# Altium schematic sheet RobotCtrl_Power.SchDoc
size A3; Author: Power Lin; DocumentNumber: 1; Revision: 0.3B; SheetNumber: 1; SheetTotal: 1; Website: wiki-power.com
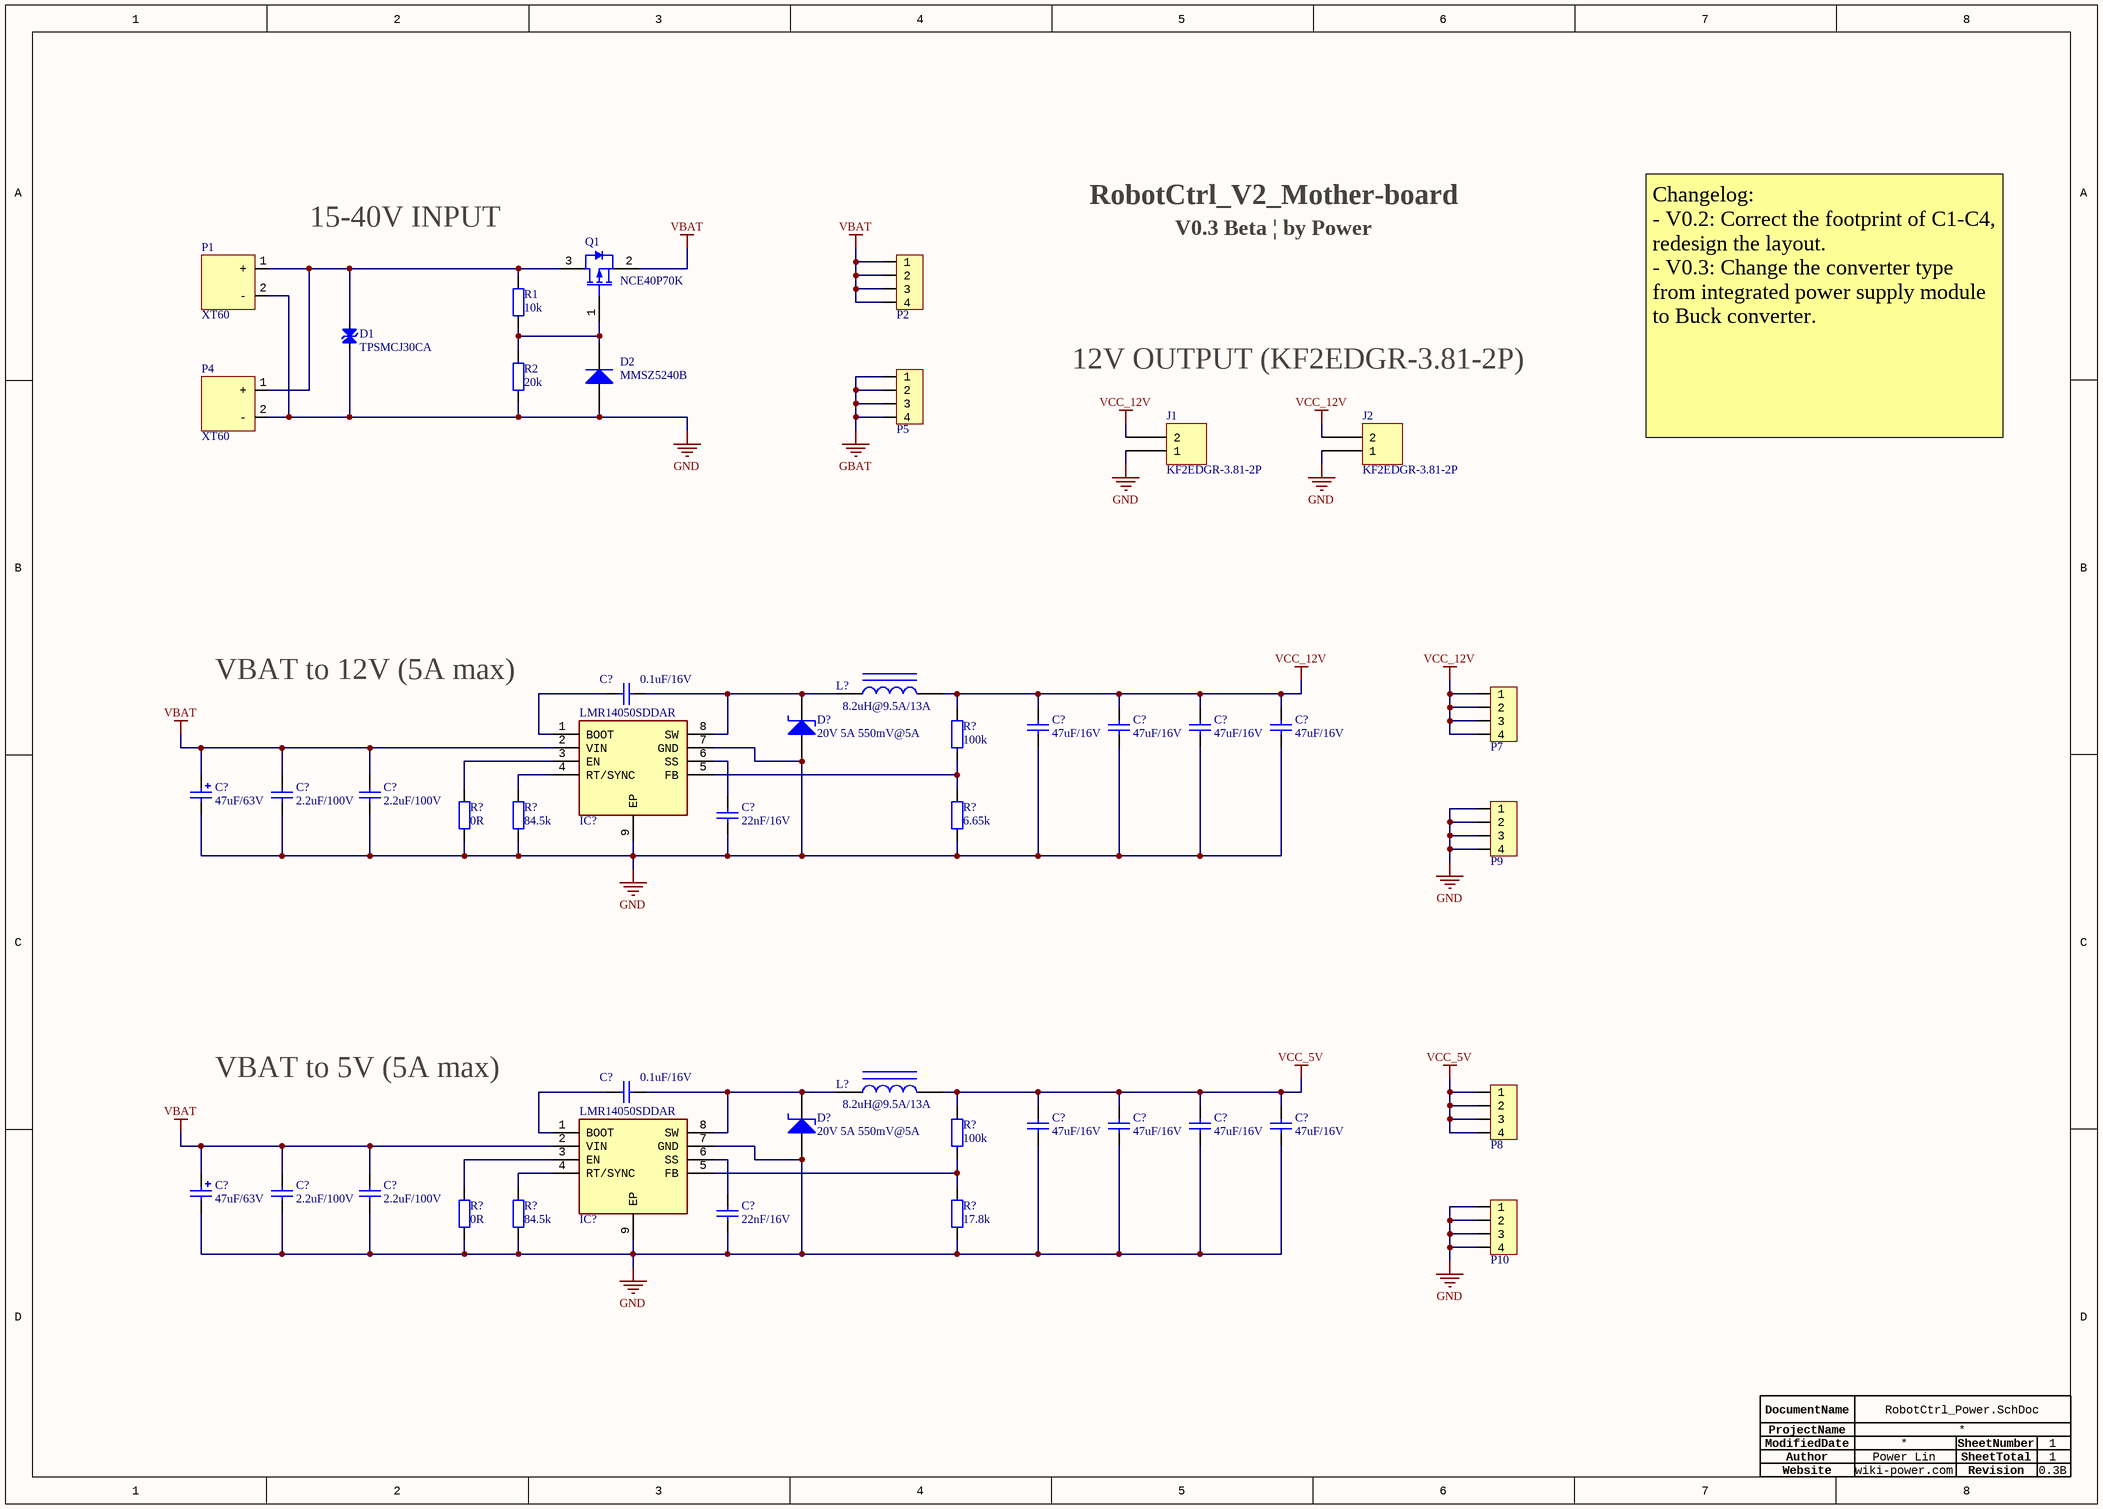
[diagram p0: RobotCtrl_Power.SchDoc]

## Parts
(Parts that share a designator on the sheet are numbered #1, #2 ... from top to bottom, then left to right.)
C?#1  0.1uF/16V  [CAP-0603]
C?#2  47uF/63V  [C_SMD-8X10]
C?#3  47uF/16V  [CAP-1210]
C?#4  47uF/16V  [CAP-1210]
C?#5  47uF/16V  [CAP-1210]
C?#6  47uF/16V  [CAP-1210]
C?#7  2.2uF/100V  [CAP-1206]
C?#8  2.2uF/100V  [CAP-1206]
C?#9  22nF/16V  [CAP-0603]
C?#10  0.1uF/16V  [CAP-0603]
C?#11  47uF/63V  [C_SMD-8X10]
C?#12  47uF/16V  [CAP-1210]
C?#13  47uF/16V  [CAP-1210]
C?#14  47uF/16V  [CAP-1210]
C?#15  47uF/16V  [CAP-1210]
C?#16  2.2uF/100V  [CAP-1206]
C?#17  2.2uF/100V  [CAP-1206]
C?#18  22nF/16V  [CAP-0603]
D1  TPSMCJ30CA  [DO-214AB/SMC]
D2  MMSZ5240B  [SOD_123]
D?#1  20V 5A 550mV@5A  [DO-214AB/SMC]
D?#2  20V 5A 550mV@5A  [DO-214AB/SMC]
IC?#1  LMR14050SDDAR  [HSOIC-8]
IC?#2  LMR14050SDDAR  [HSOIC-8]
J1  KF2EDGR-3.81-2P  [FCI 06-381-2PIN]
J2  KF2EDGR-3.81-2P  [FCI 06-381-2PIN]
L?#1  8.2uH@9.5A/13A  [SMD-13.45x12.6x4.8mm]
L?#2  8.2uH@9.5A/13A  [SMD-13.45x12.6x4.8mm]
P1  XT60  [XT60PW-M]
P2  HDR1x4_2.54  [HDR1x4_2.54_180]  (value not drawn)
P4  XT60  [XT60PW-M]
P5  HDR1x4_2.54  [HDR1x4_2.54_180]  (value not drawn)
P7  HDR1x4_2.54  [HDR1x4_2.54_180]  (value not drawn)
P8  HDR1x4_2.54  [HDR1x4_2.54_180]  (value not drawn)
P9  HDR1x4_2.54  [HDR1x4_2.54_180]  (value not drawn)
P10  HDR1x4_2.54  [HDR1x4_2.54_180]  (value not drawn)
Q1  NCE40P70K  [TO-252]
R1  10k  [R-0603]
R2  20k  [R-0603]
R?#1  100k  [R-0603]
R?#2  0R  [R-0603]
R?#3  84.5k  [R-0603]
R?#4  6.65k  [R-0603]
R?#5  100k  [R-0603]
R?#6  0R  [R-0603]
R?#7  84.5k  [R-0603]
R?#8  17.8k  [R-0603]

## Nets
GBAT: P5.1 P5.2 P5.3 P5.4
GND: C?#2.2 C?#3.1 C?#4.1 C?#5.1 C?#6.1 C?#7.1 C?#8.1 C?#9.1 C?#11.2 C?#12.1 C?#13.1 C?#14.1 C?#15.1 C?#16.1 C?#17.1 C?#18.1 D1.1 D2.1(A) D?#1.1(A) D?#2.1(A) IC?#1.7(GND) IC?#1.9(EP) IC?#2.7(GND) IC?#2.9(EP) J1.1 J2.1 P1.2(-) P4.2(-) P9.1 P9.2 P9.3 P9.4 P10.1 P10.2 P10.3 P10.4 R2.2 R?#2.1 R?#3.1 R?#4.1 R?#6.1 R?#7.1 R?#8.1
VBAT: C?#2.1 C?#7.2 C?#8.2 C?#11.1 C?#16.2 C?#17.2 IC?#1.2(VIN) IC?#2.2(VIN) P2.1 P2.2 P2.3 P2.4 Q1.2(SOURCE)
VCC_5V: C?#12.2 C?#13.2 C?#14.2 C?#15.2 L?#2.2 P8.1 P8.2 P8.3 P8.4 R?#5.2
VCC_12V: C?#3.2 C?#4.2 C?#5.2 C?#6.2 J1.2 J2.2 L?#1.2 P7.1 P7.2 P7.3 P7.4 R?#1.2
NetC?#1_1: C?#1.1 IC?#1.1(BOOT)
NetC?#1_2: C?#1.2 D?#1.2(K) IC?#1.8(SW) L?#1.1
NetC?#9_2: C?#9.2 IC?#1.6(SS)
NetC?#10_1: C?#10.1 IC?#2.1(BOOT)
NetC?#10_2: C?#10.2 D?#2.2(K) IC?#2.8(SW) L?#2.1
NetC?#18_2: C?#18.2 IC?#2.6(SS)
NetD1_2: D1.2 P1.1(+) P4.1(+) Q1.3(DRAIN) R1.1
NetD2_2: D2.2(K) Q1.1(GATE) R1.2 R2.1
NetIC?#1_3: IC?#1.3(EN) R?#2.2
NetIC?#1_4: IC?#1.4(RT/SYNC) R?#3.2
NetIC?#1_5: IC?#1.5(FB) R?#1.1 R?#4.2
NetIC?#2_3: IC?#2.3(EN) R?#6.2
NetIC?#2_4: IC?#2.4(RT/SYNC) R?#7.2
NetIC?#2_5: IC?#2.5(FB) R?#5.1 R?#8.2

## Notes on the sheet
- 15-40V INPUT
- RobotCtrl_V2_Mother-board
- V0.3 Beta | by Power
- 12V OUTPUT (KF2EDGR-3.81-2P)
- Changelog:
  - V0.2: Correct the footprint of C1-C4, redesign the layout.
  - V0.3: Change the converter type from integrated power supply module to Buck converter.
- VBAT to 12V (5A max)
- VBAT to 5V (5A max)
- Author
- DocumentName
- ModifiedDate
- ProjectName
- SheetNumber
- SheetTotal
- Website
- Revision

## Library data of the parts
C?#1 C?#10 = CAP: CC0603KRX7R7BB104; ComponentLink1Description: 供应商链接; ComponentLink1URL: http://www.szlcsc.com/product/details_53938.html; Package: 0402; Supplier: LC; SuppliersPartNumber: C52923
C?#2 C?#11 = CAP-POL: RVT1J470M0810; ComponentLink1Description: 供应商链接; ComponentLink1URL: http://www.szlcsc.com/product/details_16815.html; Package: 3528; Supplier: LC; SuppliersPartNumber: C16133
C?#3-C?#6 C?#12-C?#15 = CAP: C1210X5R476K160NT; ComponentLink1Description: 供应商链接; ComponentLink1URL: http://www.szlcsc.com/product/details_53938.html; Package: 0402; Supplier: LC; SuppliersPartNumber: C52923
C?#7 C?#8 C?#16 C?#17 = CAP: CS3216X7R225K101NRI; ComponentLink1Description: 供应商链接; ComponentLink1URL: http://www.szlcsc.com/product/details_53938.html; Package: 0402; Supplier: LC; SuppliersPartNumber: C52923
C?#9 C?#18 = CAP: CC0603KRX7R7BB223; ComponentLink1Description: 供应商链接; ComponentLink1URL: http://www.szlcsc.com/product/details_53938.html; Package: 0402; Supplier: LC; SuppliersPartNumber: C52923
D1 = TVS_C
D2 = DIODE: 稳压 10V; ComponentLink1Description: 供应商链接; ComponentLink1URL: http://www.szlcsc.com/product/details_23178.html; Package: SMA(DO-214AC); Supplier: LC; SuppliersPartNumber: C22452
D?#1 D?#2 = DIODE_Schottky: SS52
IC?#1 IC?#2 = LMR14050SDDAR: Manufacturer_Name: Texas Instruments; Datasheet Link: http://www.ti.com/lit/gpn/lmr14050; Height: 1.7mm; Manufacturer_Part_Number: LMR14050SDDAR; Mouser Part Number: 595-LMR14050SDDAR; Mouser Price/Stock: https://www.mouser.co.uk/ProductDetail/Texas-Instruments/LMR14050SDDAR?qs=G5PZsBocSXuzvyUQdQ5q2Q%3D%3D; Arrow Part Number: LMR14050SDDAR; Arrow Price/Stock: https://www.arrow.com/en/products/lmr14050sddar/texas-instruments?region=nac
J1 J2 = KF2EDGR-3.81-2P: TERM BLOCK HDR 2POS 90DEG 3.81MM; Part Number: OQ0232510000G; Manufacturer: Amphenol Anytek; Manufacturer: Amphenol; Number of Levels: 1; Number of Positions: 2; Header Orientation: 90°, Right Angle; Current - UL: 10A; Pitch: 0.150" (3.81mm); Voltage - UL: 300V; Lifecycle Status: 0; ComponentLink1Description: Datasheet; Series: 06-381; Color: Green; Termination Style: Solder; Minimum Order: 1; Type: Header, Male Pins, Shrouded (4 Side); LastUpdated: 2019-12-16 19:14:30.110; Operating Temperature: -40°C ~ 115°C; Packaging: Bulk; ComponentLink1URL: http://portal.fciconnect.com/Comergent//fci/drawing/oqxx32x100j0g.pdf; Price: 0.49; Mounting Type: Through Hole; Positions Per Level: 2; Contact Mating Finish: Tin; Part Status: Active; Manufacturer Part Number: OQ0232510000G; Component Type: 接线端子
L?#1 L?#2 = INDUCTOR: MDE1250-8R2M; ComponentLink1Description: 供应商链接; ComponentLink1URL: http://www.szlcsc.com/product/details_33003.html; Package: 0402; Supplier: LC; SuppliersPartNumber: C32041
P1 P4 = XT30/60
P2 P5 = HDR1x4_2.54: Header
P7-P10 = HDR1x4_2.54: Header; System: Connector
Q1 = P-MOS: Manufacturer: NCE Power; Mounting Technology: SM; Package Reference: SOT23-3; Case/Package: SOT23-3; Package Description: 3-Pin Small Outline Transistor, Body 2.9 x 1.3 mm, Pitch 0.95 mm; Datasheet Version: Rev. 1.1, 07/2014; RoHS Compliant: Unknown; Datasheet URL: http://www.ncepower.com/Upload/MOSFET/mos1/55vpmos/NCE3407Adatasheet-17275285683.pdf; Component Type: Transistors
R1 R2 = RES: 贴片电阻; Package: 0805; Supplier: LC; SuppliersPartNumber: C17798
R?#1 R?#5 = RES: RC0603FR-07100KL; Package: 0805; Supplier: LC; SuppliersPartNumber: C17798
R?#2 R?#6 = RES: DNP; Package: 0805; Supplier: LC; SuppliersPartNumber: C17798
R?#3 R?#7 = RES: RC0603FR-0784K5L; Package: 0805; Supplier: LC; SuppliersPartNumber: C17798
R?#4 = RES: RC0603FR-076K65L; Package: 0805; Supplier: LC; SuppliersPartNumber: C17798
R?#8 = RES: RC0603FR-0717K8L; Package: 0805; Supplier: LC; SuppliersPartNumber: C17798